# EAGLE design main_board (EAGLE 9.4.2)

## Sheet 1 of 5
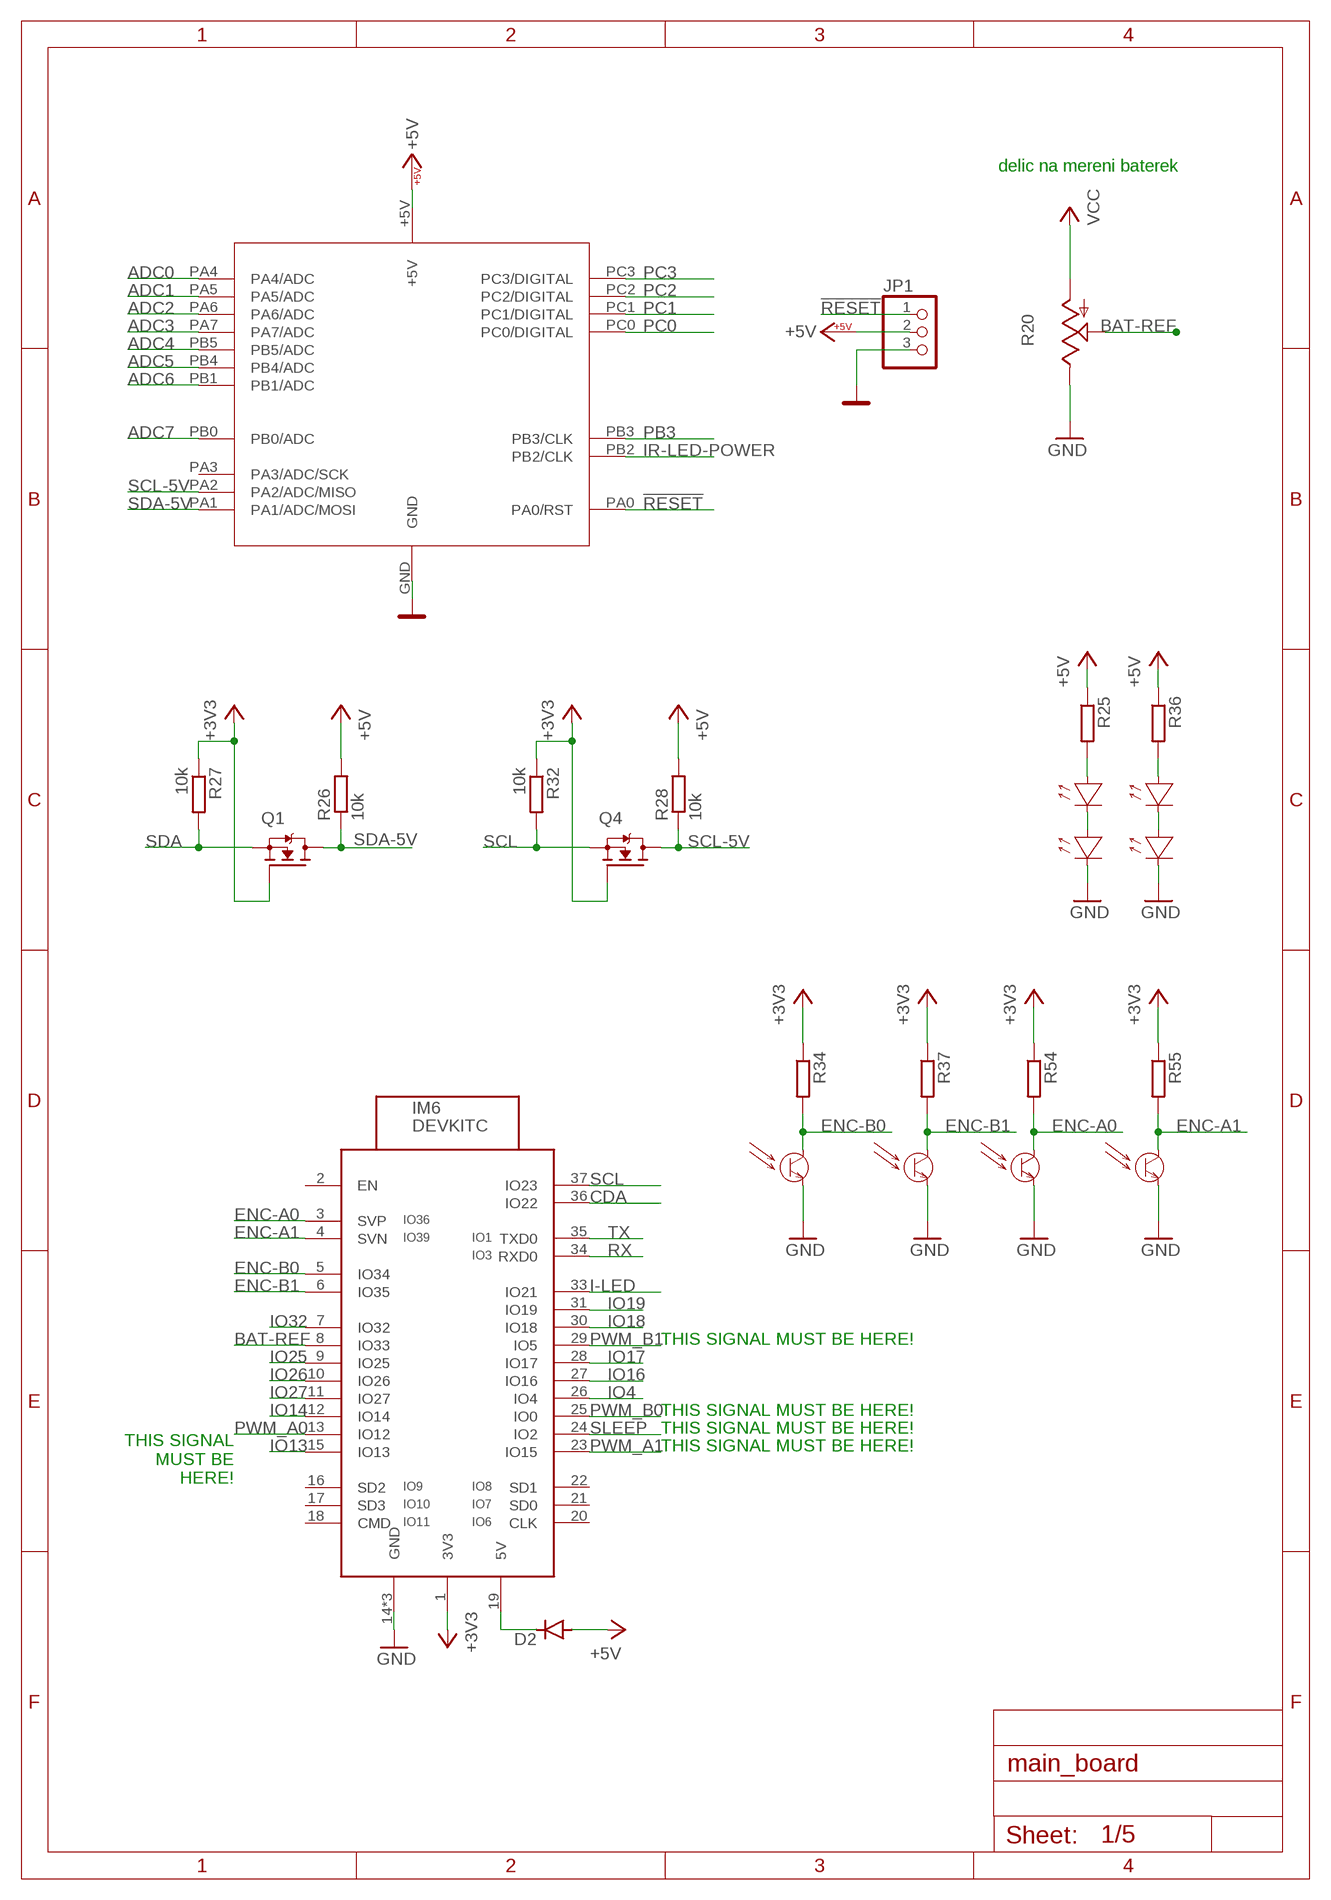
[diagram p0: schematic, sheet 1]

### Parts
D2  DIODE-D-7.5  [D-7.5]
IM6  DEVKITC  [DEVKITC]
JP1  PINHD-1X3  [1X03]
Q1  N-MOSFET-SOT23-DIST  [SOT23_DIST]
Q4  N-MOSFET-SOT23-DIST  [SOT23_DIST]
R20  TRIM_US-SM-42/43X  [SM-42/43X]
R25  R-EU_R0603  [R0603]
R26  10k  R-EU_R0402  [R0402]
R27  10k  R-EU_R0402  [R0402]
R28  10k  R-EU_R0402  [R0402]
R32  10k  R-EU_R0402  [R0402]
R34  R-EU_R0603  [R0603]
R36  R-EU_R0603  [R0603]
R37  R-EU_R0603  [R0603]
R54  R-EU_R0603  [R0603]
R55  R-EU_R0603  [R0603]
U$8  ATTINI1616SOIC  [ATTINY1616-SOIC]
U$11  BIR-NM13C1  [BIR-NM13C1]
U$13  L-NP-3C1  [L-NP-3C1]
U$15  BIR-NM13C1  [BIR-NM13C1]
U$16  BIR-NM13C1  [BIR-NM13C1]
U$20  BIR-NM13C1  [BIR-NM13C1]
U$21  L-NP-3C1  [L-NP-3C1]
U$22  L-NP-3C1  [L-NP-3C1]
U$23  L-NP-3C1  [L-NP-3C1]

### Nets
!RESET: JP1.1 U$8.PA0(PA0/RST)
+3V3: IM6.1(3V3) Q1.1(G) Q4.1(G) R27.1 R32.1 R34.1 R37.1 R54.1 R55.1 ; also sheet 4,5
+5V: D2.A JP1.2 R25.1 R26.2 R28.2 R36.1 U$8.+5V ; also sheet 2,3,4,5
+5V_ESP: D2.C IM6.19(5V)
ADC0: U$8.PA4(PA4/ADC) ; also sheet 3
ADC1: U$8.PA5(PA5/ADC) ; also sheet 3
ADC2: U$8.PA6(PA6/ADC) ; also sheet 3
ADC3: U$8.PA7(PA7/ADC) ; also sheet 3
ADC4: U$8.PB5(PB5/ADC) ; also sheet 3
ADC5: U$8.PB4(PB4/ADC) ; also sheet 3
ADC6: U$8.PB1(PB1/ADC) ; also sheet 3
ADC7: U$8.PB0(PB0/ADC)
BAT-REF: IM6.8(IO33) R20.2(S)
CDA: IM6.36(IO22)
ENC-A0: IM6.3(SVP) R54.2 U$22.PIN
ENC-A1: IM6.4(SVN) R55.2 U$23.PIN
ENC-B0: IM6.5(IO34) R34.2 U$13.PIN
ENC-B1: IM6.6(IO35) R37.2 U$21.PIN
GND: IM6.14(GND) IM6.32(GND) IM6.38(GND) JP1.3 R20.3(E) U$8.GND U$11.GND U$13.GND U$20.GND U$21.GND U$22.GND U$23.GND ; also sheet 2,3,4,5
I-LED: IM6.33(IO21) ; also sheet 5
IO4: IM6.26(IO4) ; also sheet 5
IO13: IM6.15(IO13) ; also sheet 5
IO14: IM6.12(IO14) ; also sheet 5
IO16: IM6.27(IO16) ; also sheet 5
IO17: IM6.28(IO17) ; also sheet 5
IO18: IM6.30(IO18) ; also sheet 5
IO19: IM6.31(IO19) ; also sheet 5
IO25: IM6.9(IO25) ; also sheet 5
IO26: IM6.10(IO26) ; also sheet 5
IO27: IM6.11(IO27) ; also sheet 5
IO32: IM6.7(IO32) ; also sheet 5
IR-LED-POWER: U$8.PB2(PB2/CLK) ; also sheet 3
N$12: R25.2 U$16.PIN(VCC)
N$21: U$11.PIN(VCC) U$16.GND
N$22: R36.2 U$15.PIN(VCC)
N$31: U$15.GND U$20.PIN(VCC)
PB3: U$8.PB3(PB3/CLK) ; also sheet 2
PC0: U$8.PC0(PC0/DIGITAL) ; also sheet 2
PC1: U$8.PC1(PC1/DIGITAL) ; also sheet 2
PC2: U$8.PC2(PC2/DIGITAL) ; also sheet 2
PC3: U$8.PC3(PC3/DIGITAL)
PWM_A0: IM6.13(IO12) ; also sheet 4
PWM_A1: IM6.23(IO15) ; also sheet 4
PWM_B0: IM6.25(IO0) ; also sheet 4
PWM_B1: IM6.29(IO5) ; also sheet 4
RX: IM6.34(RXD0) ; also sheet 5
SCL: IM6.37(IO23) Q4.2(S) R32.2
SCL-5V: Q4.3(D) R28.1 U$8.PA2(PA2/ADC/MISO)
SDA: Q1.2(S) R27.2
SDA-5V: Q1.3(D) R26.1 U$8.PA1(PA1/ADC/MOSI)
SLEEP: IM6.24(IO2) ; also sheet 4
TX: IM6.35(TXD0) ; also sheet 5
VCC: R20.1(A) ; also sheet 4
Unconnected: IM6.2(EN) IM6.16(SD2) IM6.17(SD3) IM6.18(CMD) IM6.20(CLK) IM6.21(SD0) IM6.22(SD1) U$8.PA3(PA3/ADC/SCK)

### Notes on the sheet
- delic na mereni baterek
- THIS SIGNAL MUST BE HERE!
- THIS SIGNAL MUST BE HERE!
- THIS SIGNAL
  MUST BE
  HERE!
- THIS SIGNAL MUST BE HERE!
- THIS SIGNAL MUST BE HERE!

## Sheet 2 of 5
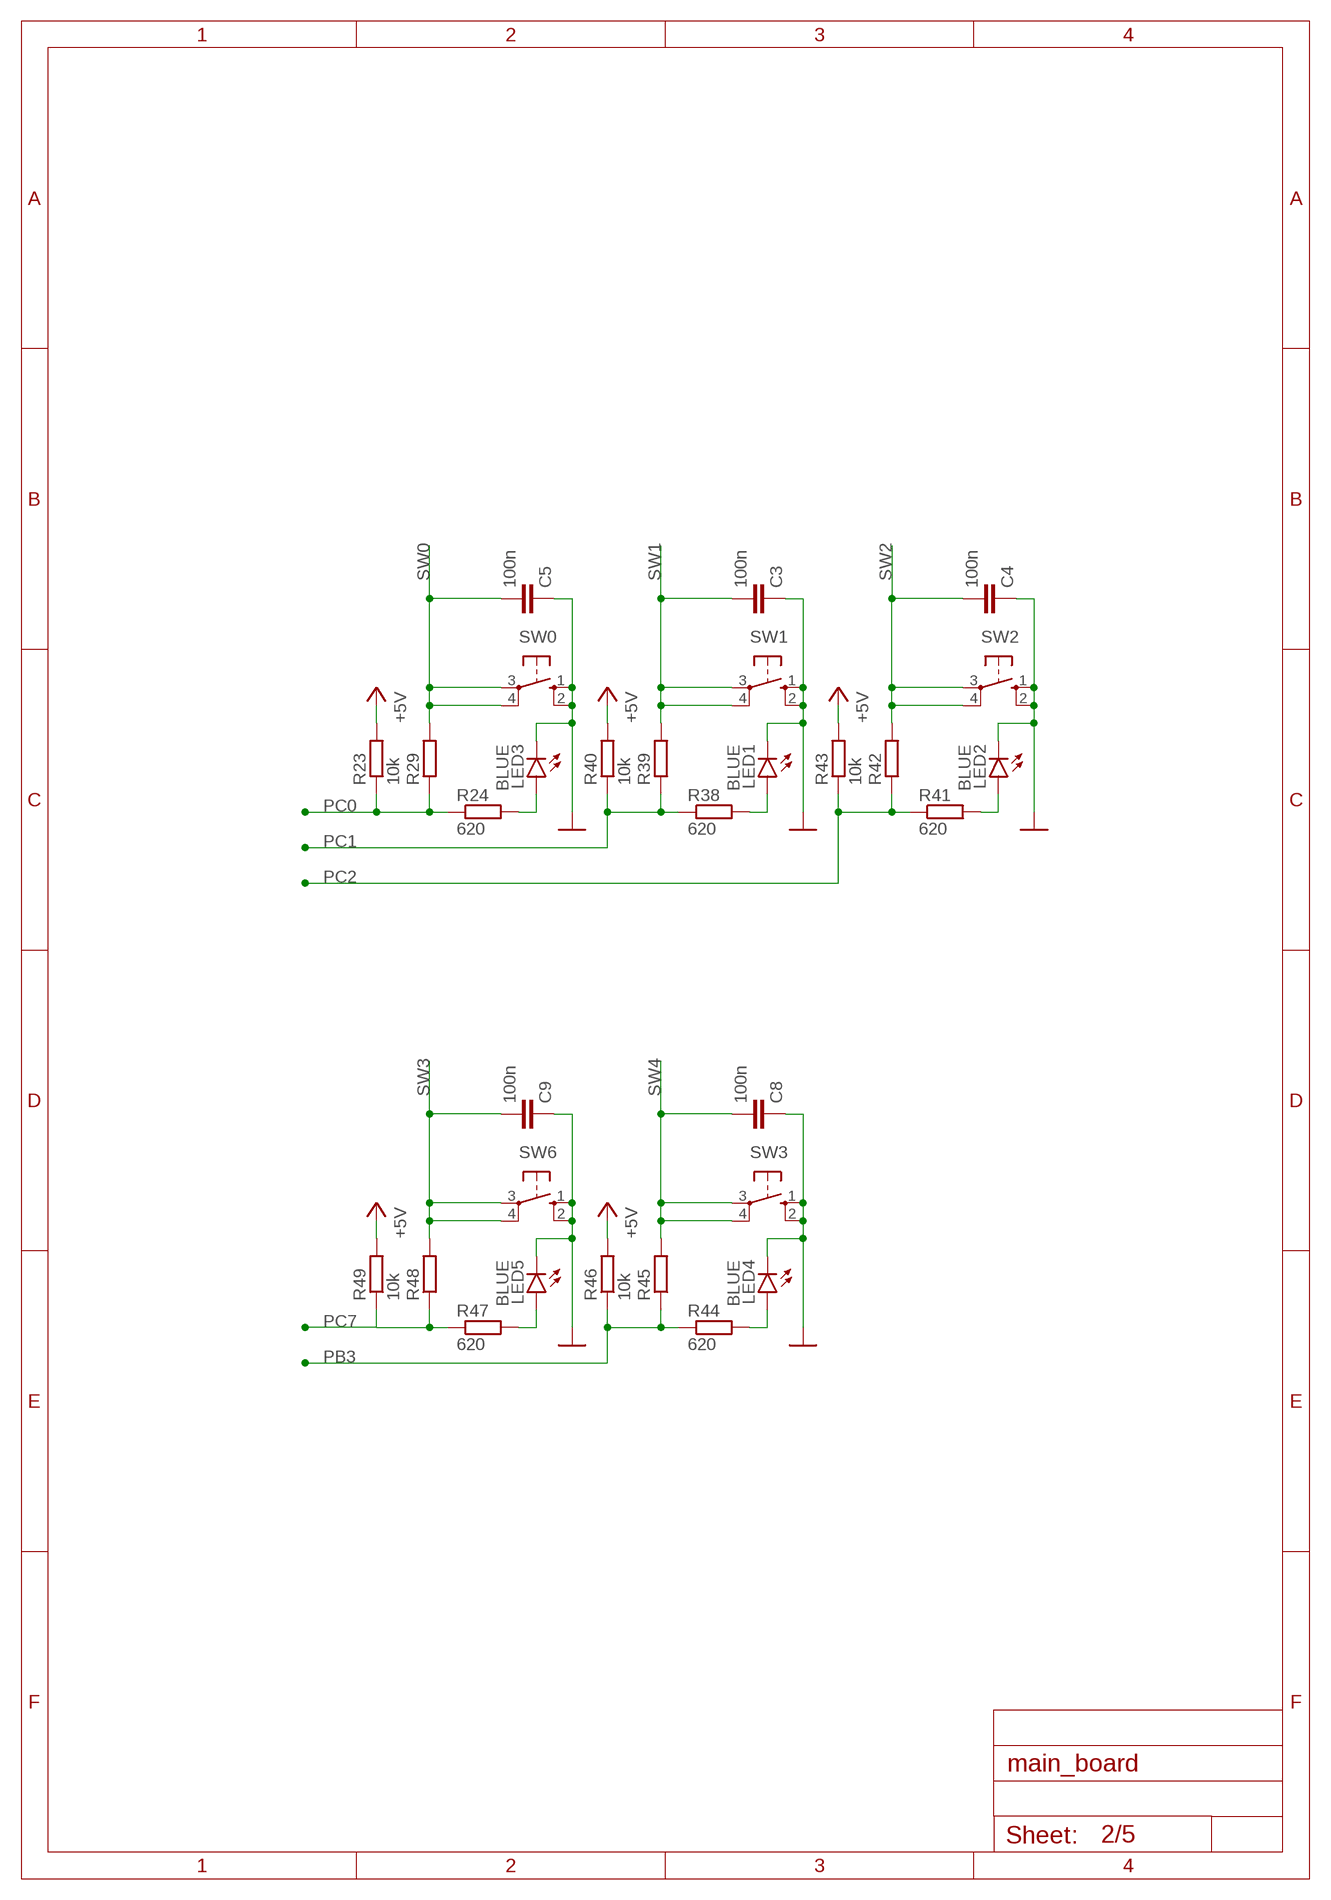
[diagram p1: schematic, sheet 2]

### Parts
C3  100n  C-EUC1206  [C1206]
C4  100n  C-EUC1206  [C1206]
C5  100n  C-EUC1206  [C1206]
C8  100n  C-EUC1206  [C1206]
C9  100n  C-EUC1206  [C1206]
LED1  BLUE  LEDCHIPLED_1206  [CHIPLED_1206]
LED2  BLUE  LEDCHIPLED_1206  [CHIPLED_1206]
LED3  BLUE  LEDCHIPLED_1206  [CHIPLED_1206]
LED4  BLUE  LEDCHIPLED_1206  [CHIPLED_1206]
LED5  BLUE  LEDCHIPLED_1206  [CHIPLED_1206]
R23  10k  R-EU_R0805  [R0805]
R24  620  R-EU_R0805  [R0805]
R29  R-EU_R0805  [R0805]
R38  620  R-EU_R0805  [R0805]
R39  R-EU_R0805  [R0805]
R40  10k  R-EU_R0805  [R0805]
R41  620  R-EU_R0805  [R0805]
R42  R-EU_R0805  [R0805]
R43  10k  R-EU_R0805  [R0805]
R44  620  R-EU_R0805  [R0805]
R45  R-EU_R0805  [R0805]
R46  10k  R-EU_R0805  [R0805]
R47  620  R-EU_R0805  [R0805]
R48  R-EU_R0805  [R0805]
R49  10k  R-EU_R0805  [R0805]
SW0  10-XX  [B3F-10XX]
SW1  10-XX  [B3F-10XX]
SW2  10-XX  [B3F-10XX]
SW3  10-XX  [B3F-10XX]
SW6  10-XX  [B3F-10XX]

### Nets
+5V: R23.2 R40.2 R43.2 R46.2 R49.2 ; also sheet 1,3,4,5
GND: C3.1 C4.1 C5.1 C8.1 C9.1 LED1.C LED2.C LED3.C LED4.C LED5.C SW0.1(S) SW0.2(S1) SW1.1(S) SW1.2(S1) SW2.1(S) SW2.2(S1) SW3.1(S) SW3.2(S1) SW6.1(S) SW6.2(S1) ; also sheet 1,3,4,5
N$10: LED3.A R24.2
N$24: LED2.A R41.2
N$26: LED1.A R38.2
N$27: LED4.A R44.2
N$28: LED5.A R47.2
PB3: R44.1 R45.1 R46.1 ; also sheet 1
PC0: R23.1 R24.1 R29.1 ; also sheet 1
PC1: R38.1 R39.1 R40.1 ; also sheet 1
PC2: R41.1 R42.1 R43.1 ; also sheet 1
PC7: R47.1 R48.1 R49.1
SW0: C5.2 R29.2 SW0.3(P) SW0.4(P1) ; also sheet 5
SW1: C3.2 R39.2 SW1.3(P) SW1.4(P1) ; also sheet 5
SW2: C4.2 R42.2 SW2.3(P) SW2.4(P1) ; also sheet 5
SW3: C9.2 R48.2 SW6.3(P) SW6.4(P1) ; also sheet 5
SW4: C8.2 R45.2 SW3.3(P) SW3.4(P1) ; also sheet 5

## Sheet 3 of 5
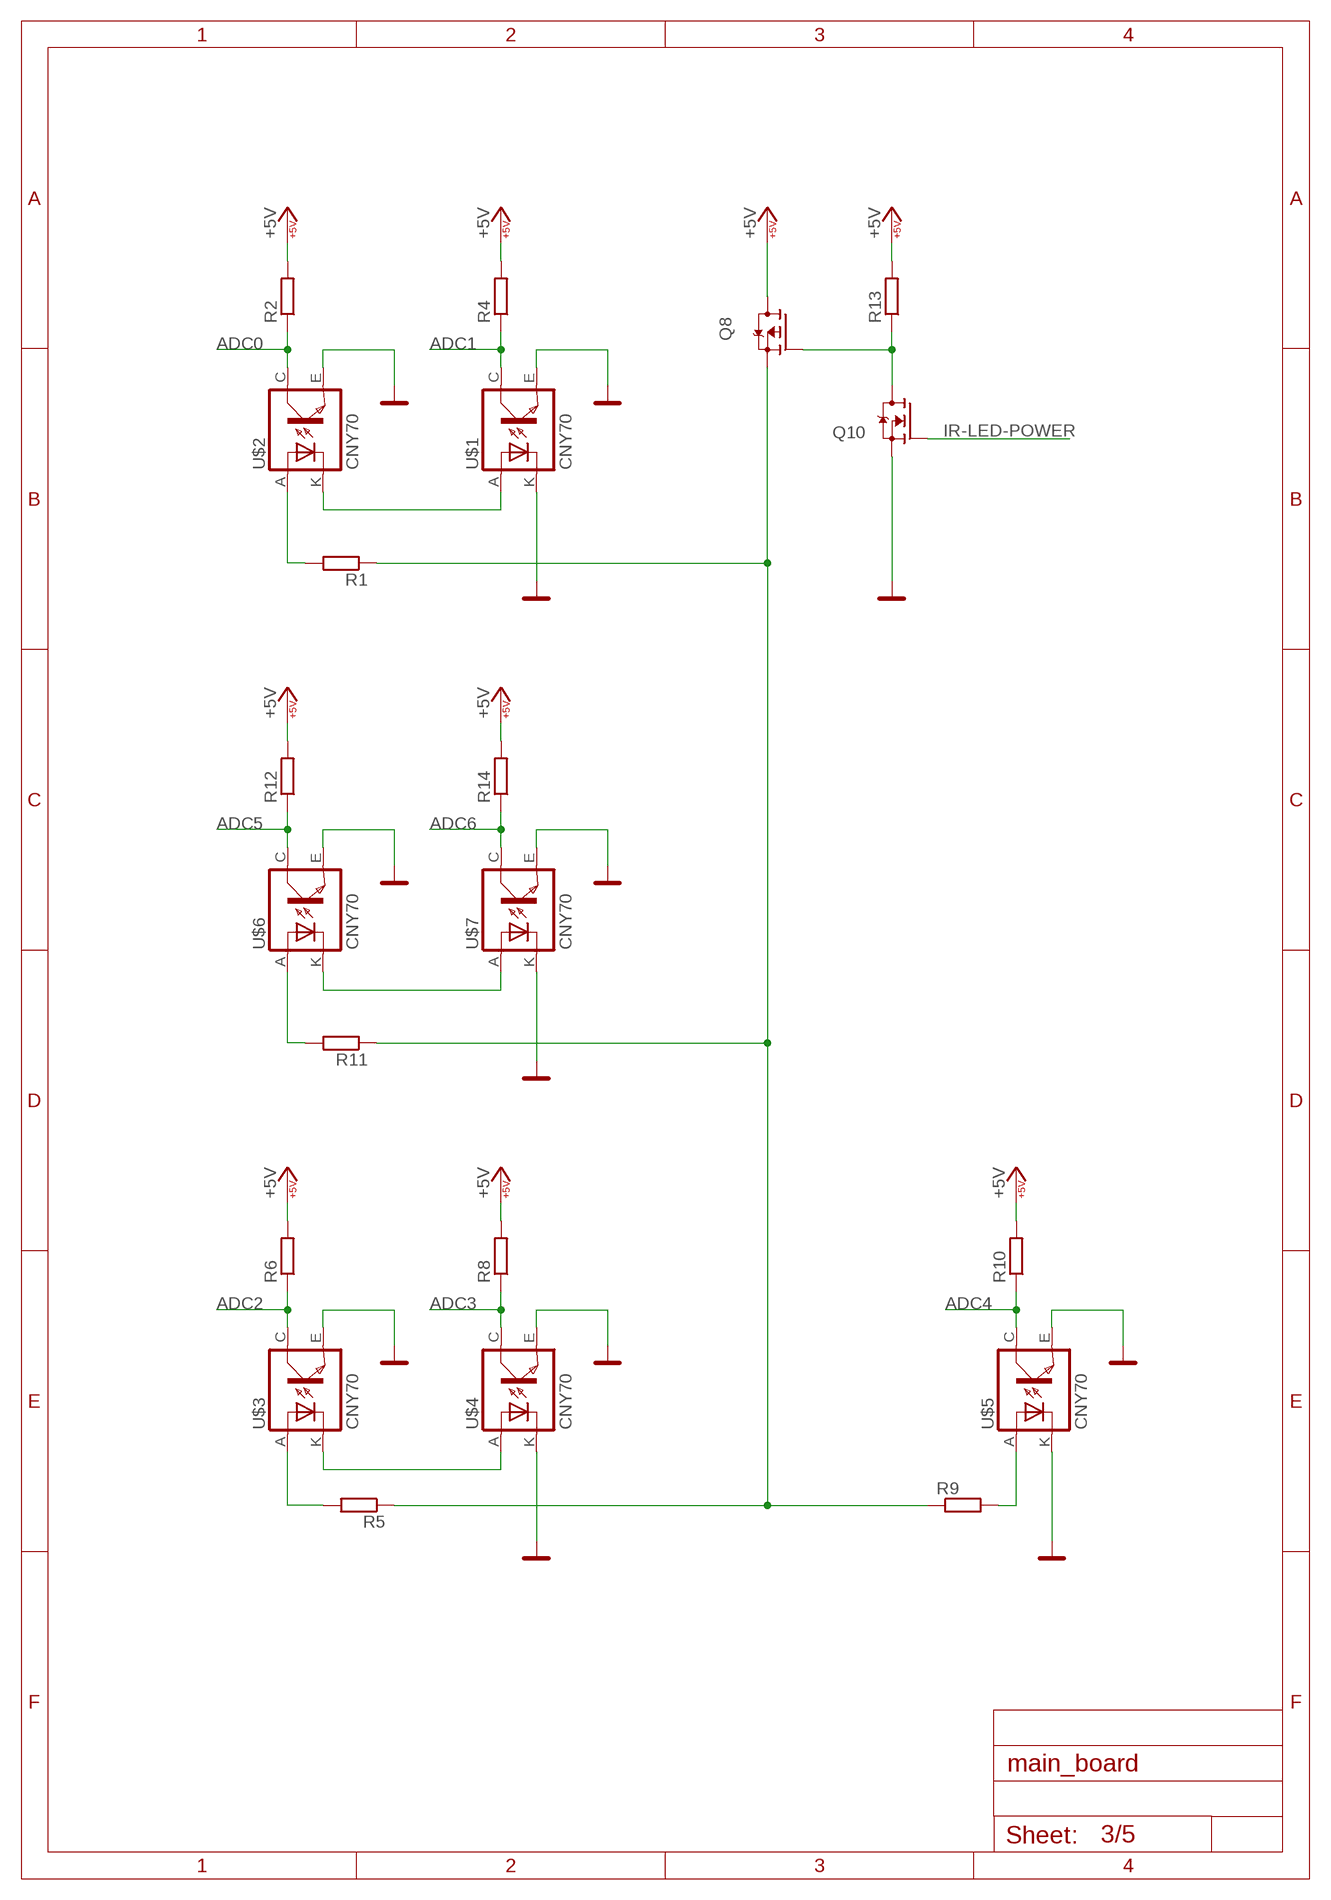
[diagram p2: schematic, sheet 3]

### Parts
Q8  P-MOSFET-MLP_HS  [MLP3.3X3.3_HS]
Q10  N-MOSFET-SOT23-GSD  [SOT23]
R1  R-EU_R0603  [R0603]
R2  R-EU_R0603  [R0603]
R4  R-EU_R0603  [R0603]
R5  R-EU_R0603  [R0603]
R6  R-EU_R0603  [R0603]
R8  R-EU_R0603  [R0603]
R9  R-EU_R0603  [R0603]
R10  R-EU_R0603  [R0603]
R11  R-EU_R0603  [R0603]
R12  R-EU_R0603  [R0603]
R13  R-EU_R0603  [R0603]
R14  R-EU_R0603  [R0603]
U$1  CNY70  [4]
U$2  CNY70  [4]
U$3  CNY70  [4]
U$4  CNY70  [4]
U$5  CNY70  [4]
U$6  CNY70  [4]
U$7  CNY70  [4]

### Nets
+5V: Q8.5(D) Q8.6(D) Q8.7(D) Q8.8(D) R2.2 R4.2 R6.2 R8.2 R10.2 R12.2 R13.2 R14.2 ; also sheet 1,2,4,5
ADC0: R2.1 U$2.C(COL) ; also sheet 1
ADC1: R4.1 U$1.C(COL) ; also sheet 1
ADC2: R6.1 U$3.C(COL) ; also sheet 1
ADC3: R8.1 U$4.C(COL) ; also sheet 1
ADC4: R10.1 U$5.C(COL) ; also sheet 1
ADC5: R12.1 U$6.C(COL) ; also sheet 1
ADC6: R14.1 U$7.C(COL) ; also sheet 1
GND: Q10.2(S) U$1.E(EMI) U$1.K(C) U$2.E(EMI) U$3.E(EMI) U$4.E(EMI) U$4.K(C) U$5.E(EMI) U$5.K(C) U$6.E(EMI) U$7.E(EMI) U$7.K(C) ; also sheet 1,2,4,5
IR-LED-POWER: Q10.1(G) ; also sheet 1
N$1: R1.2 U$2.A
N$2: U$1.A U$2.K(C)
N$3: R5.2 U$3.A
N$4: U$3.K(C) U$4.A
N$5: R9.2 U$5.A
N$6: R11.2 U$6.A
N$29: U$6.K(C) U$7.A
N$34: Q8.1(S) Q8.2(S) Q8.3(S) R1.1 R5.1 R9.1 R11.1
N$36: Q8.4(G) Q10.3(D) R13.1

## Sheet 4 of 5
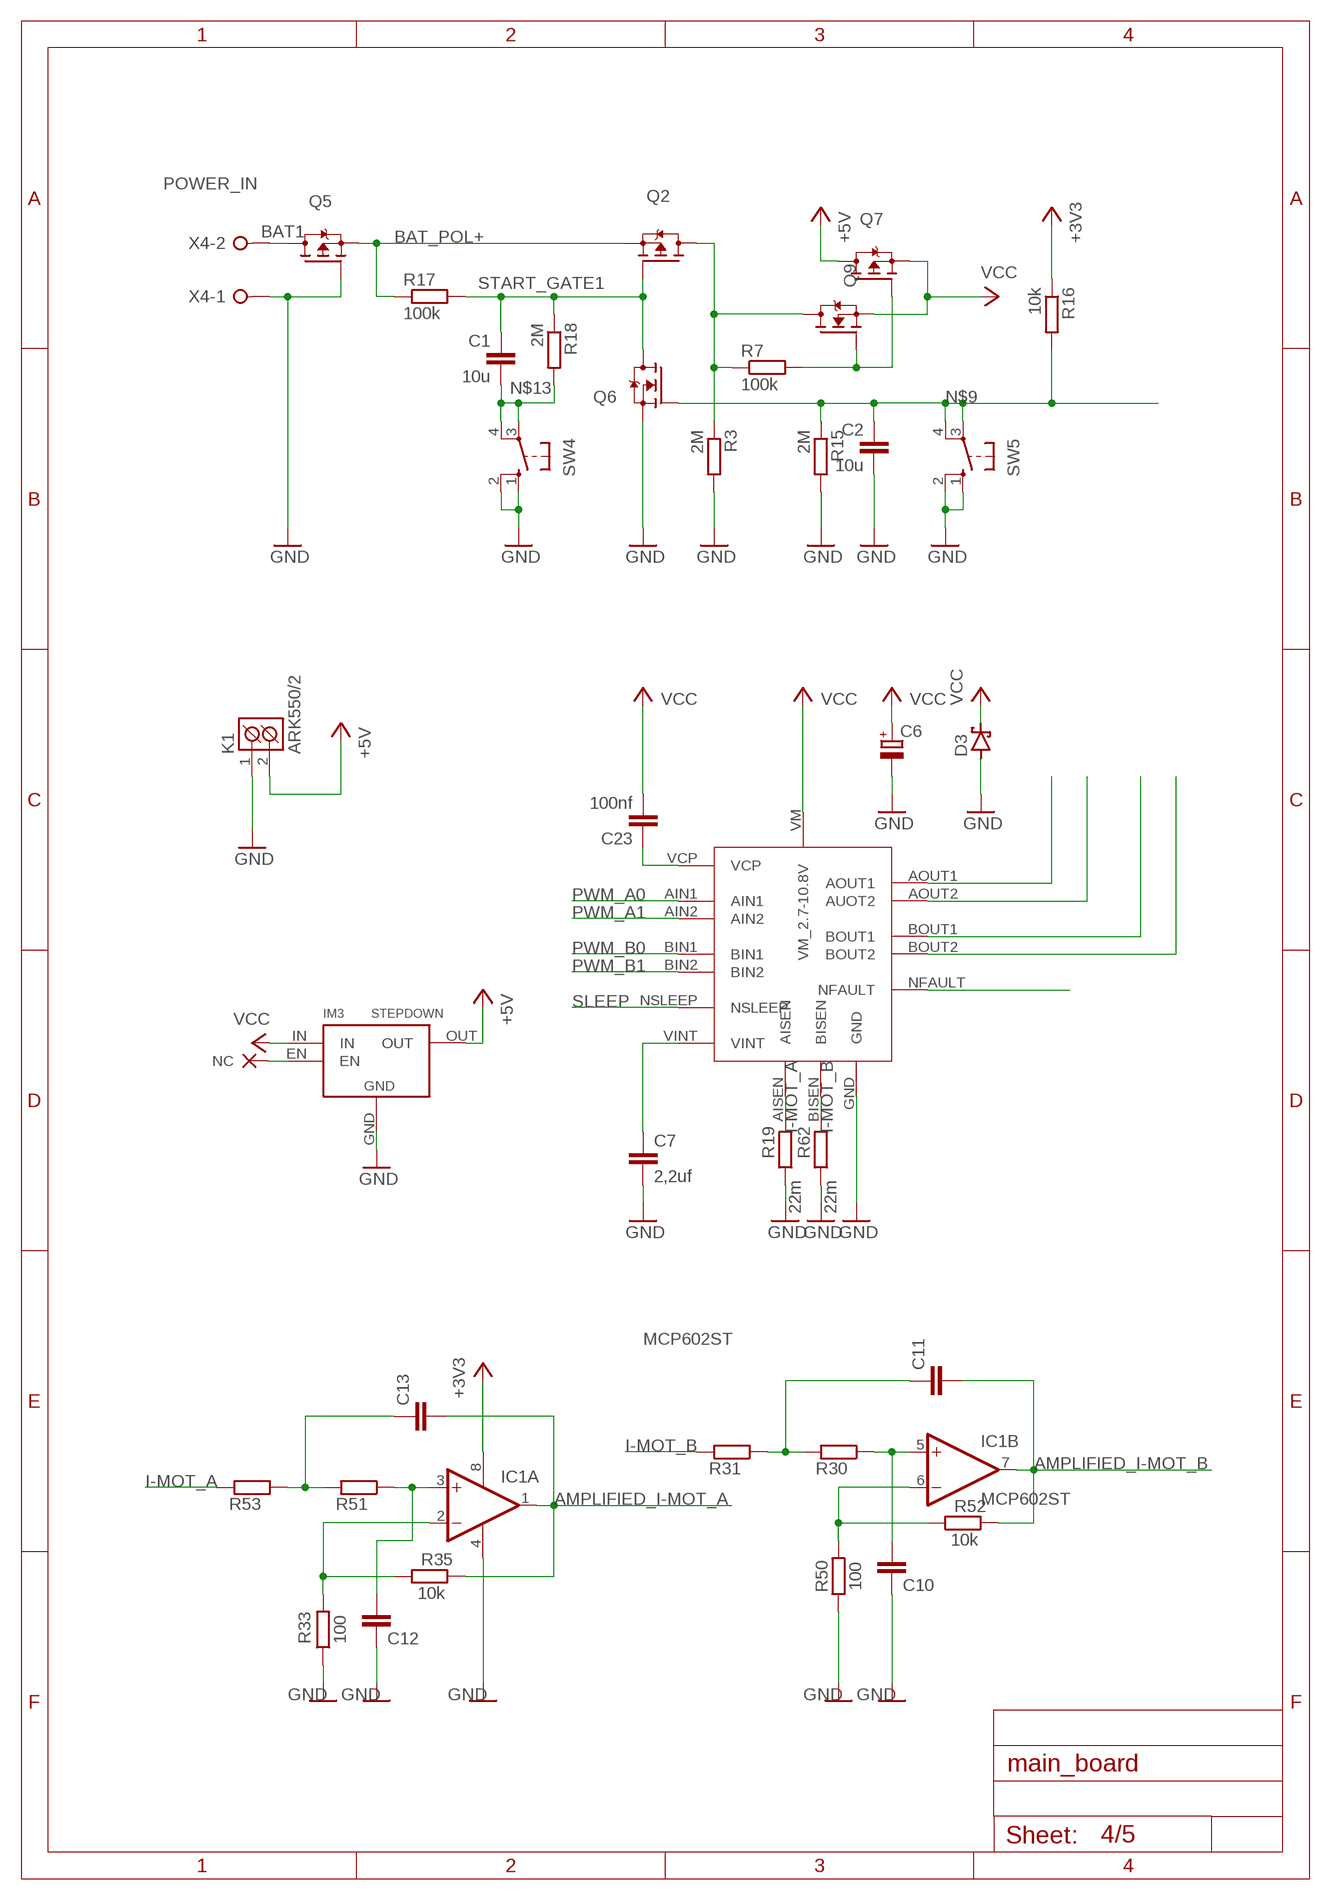
[diagram p3: schematic, sheet 4]

### Parts
C1  10u  C-EUC1206  [C1206]
C2  10u  C-EUC1206  [C1206]
C6  CPOL-EUE5-10.5  [E5-10,5]
C7  2,2uf  C-EUC0805  [C0805]
C10  C-EUC1206  [C1206]
C11  C-EUC1206  [C1206]
C12  C-EUC1206  [C1206]
C13  C-EUC1206  [C1206]
C23  100nf  C-EUC0603  [C0603]
D3  SCHOTTKY-DIODEF126Z12  [F126Z12]
IC1  MCP602ST  [TSSOP8]
IM3  STEPDOWN  [STEPDOWN]
K1  ARK550/2  [ARK550/2]
NC1  NC  (no package)
Q2  P-MOSFET-MLP_HS  [MLP3.3X3.3_HS]
Q5  P-MOSFET-MLP_HS  [MLP3.3X3.3_HS]
Q6  N-MOSFET-SOT23-GSD  [SOT23]
Q7  P-MOSFET-MLP_HS  [MLP3.3X3.3_HS]
Q9  N-MOSFET-SOT23-GSD  [SOT23]
R3  2M  R-EU_R0805  [R0805]
R7  100k  R-EU_R0805  [R0805]
R15  2M  R-EU_R0805  [R0805]
R16  10k  R-EU_R0805  [R0805]
R17  100k  R-EU_R0805  [R0805]
R18  2M  R-EU_M0805  [M0805]
R19  22m  R-EU_R0603  [R0603]
R30  R-EU_R0603  [R0603]
R31  R-EU_R0603  [R0603]
R33  100  R-EU_R0603  [R0603]
R35  10k  R-EU_R0603  [R0603]
R50  100  R-EU_R0603  [R0603]
R51  R-EU_R0603  [R0603]
R52  10k  R-EU_R0603  [R0603]
R53  R-EU_R0603  [R0603]
R62  22m  R-EU_R0603  [R0603]
SW4  10-XX  [B3F-10XX]
SW5  10-XX  [B3F-10XX]
U$9  DRV8833HTSSOP  [HTSSOP]
X4  POWER_IN  W237-02P  [W237-132]

### Nets
+3V3: IC1.8(P:V+) R16.1 ; also sheet 1,5
+5V: IM3.OUT K1.2(K2) Q7.5(D) Q7.6(D) Q7.7(D) Q7.8(D) ; also sheet 1,2,3,5
AMPLIFIED_I-MOT_A: C13.2 IC1.1(A:OUT) R35.2
AMPLIFIED_I-MOT_B: C11.2 IC1.7(B:OUT) R52.2
BAT1: Q5.5(D) Q5.6(D) Q5.7(D) Q5.8(D) X4.2
BAT_POL+: Q2.1(S) Q2.2(S) Q2.3(S) Q5.1(S) Q5.2(S) Q5.3(S) R17.1
GND: C2.2 C6.- C7.2 C10.2 C12.2 D3.A IC1.4(P:V-) IM3.GND K1.1(K1) Q5.4(G) Q6.2(S) R3.2 R15.2 R19.1 R33.1 R50.1 R62.1 SW4.1(S) SW4.2(S1) SW5.1(S) SW5.2(S1) U$9.GND X4.1 ; also sheet 1,2,3,5
I-MOT_A: R19.2 R53.2 U$9.AISEN
I-MOT_B: R31.2 R62.2 U$9.BISEN
IO9_NC2: IM3.EN NC1.NC
N$7: Q2.5(D) Q2.6(D) Q2.7(D) Q2.8(D) Q9.3(D) R3.1 R7.1
N$8: U$9.AOUT1
N$9: C2.1 Q6.1(G) R15.1 R16.2 SW5.3(P) SW5.4(P1)
N$13: C1.2 R18.2 SW4.3(P) SW4.4(P1)
N$14: U$9.AOUT2(AUOT2)
N$15: U$9.BOUT1
N$16: U$9.BOUT2
N$17: U$9.NFAULT
N$18: C11.1 R30.2 R31.1
N$19: C10.1 IC1.5(B:+IN) R30.1
N$20: IC1.2(A:-IN) R33.2 R35.1
N$23: C7.1 U$9.VINT
N$25: C23.1 U$9.VCP
N$30: IC1.6(B:-IN) R50.2 R52.1
N$32: C13.1 R51.2 R53.1
N$33: C12.1 IC1.3(A:+IN) R51.1
N$35: Q7.4(G) Q9.1(G) R7.2
PWM_A0: U$9.AIN1 ; also sheet 1
PWM_A1: U$9.AIN2 ; also sheet 1
PWM_B0: U$9.BIN1 ; also sheet 1
PWM_B1: U$9.BIN2 ; also sheet 1
SLEEP: U$9.NSLEEP ; also sheet 1
START_GATE1: C1.1 Q2.4(G) Q6.3(D) R17.2 R18.1
VCC: C6.+ C23.2 D3.C IM3.IN Q7.1(S) Q7.2(S) Q7.3(S) Q9.2(S) U$9.VM(VM_2.7-10.8V) ; also sheet 1

## Sheet 5 of 5
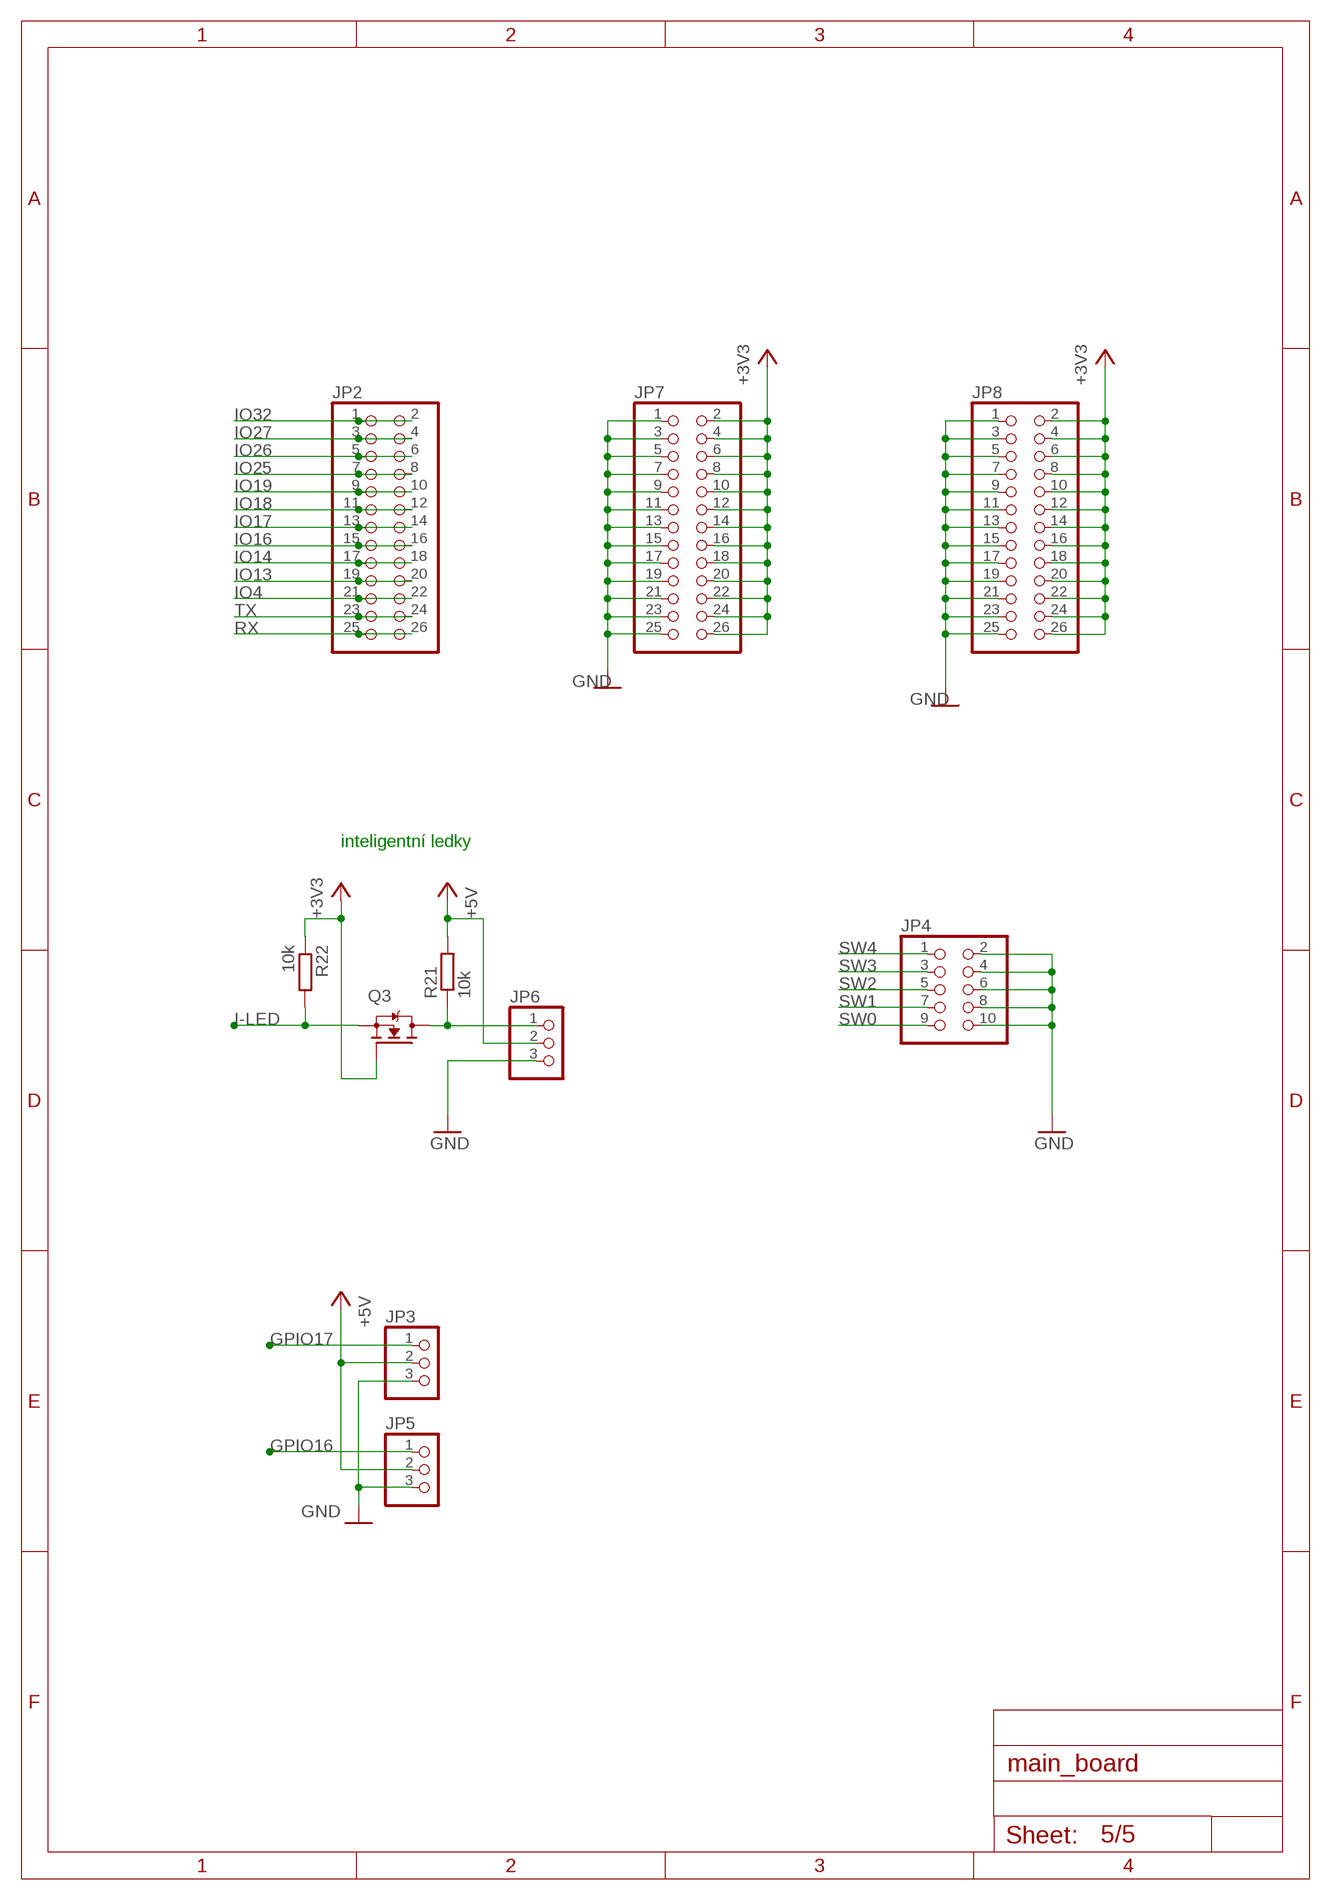
[diagram p4: schematic, sheet 5]

### Parts
JP2  PINHD-2X13  [2X13]
JP3  PINHD-1X3  [1X03]
JP4  PINHD-2X5  [2X05]
JP5  PINHD-1X3  [1X03]
JP6  PINHD-1X3  [1X03]
JP7  PINHD-2X13  [2X13]
JP8  PINHD-2X13  [2X13]
Q3  N-MOSFET-SOT23-DIST  [SOT23_DIST]
R21  10k  R-EU_R0402  [R0402]
R22  10k  R-EU_R0402  [R0402]

### Nets
+3V3: JP7.2 JP7.4 JP7.6 JP7.8 JP7.10 JP7.12 JP7.14 JP7.16 JP7.18 JP7.20 JP7.22 JP7.24 JP7.26 JP8.2 JP8.4 JP8.6 JP8.8 JP8.10 JP8.12 JP8.14 JP8.16 JP8.18 JP8.20 JP8.22 JP8.24 JP8.26 Q3.1(G) R22.1 ; also sheet 1,4
+5V: JP3.2 JP5.2 JP6.2 R21.2 ; also sheet 1,2,3,4
GND: JP3.3 JP4.2 JP4.4 JP4.6 JP4.8 JP4.10 JP5.3 JP6.3 JP7.1 JP7.3 JP7.5 JP7.7 JP7.9 JP7.11 JP7.13 JP7.15 JP7.17 JP7.19 JP7.21 JP7.23 JP7.25 JP8.1 JP8.3 JP8.5 JP8.7 JP8.9 JP8.11 JP8.13 JP8.15 JP8.17 JP8.19 JP8.21 JP8.23 JP8.25 ; also sheet 1,2,3,4
GPIO16: JP5.1
GPIO17: JP3.1
I-LED: Q3.2(S) R22.2 ; also sheet 1
IO4: JP2.21 JP2.22 ; also sheet 1
IO13: JP2.19 JP2.20 ; also sheet 1
IO14: JP2.17 JP2.18 ; also sheet 1
IO16: JP2.15 JP2.16 ; also sheet 1
IO17: JP2.13 JP2.14 ; also sheet 1
IO18: JP2.11 JP2.12 ; also sheet 1
IO19: JP2.9 JP2.10 ; also sheet 1
IO25: JP2.7 JP2.8 ; also sheet 1
IO26: JP2.5 JP2.6 ; also sheet 1
IO27: JP2.3 JP2.4 ; also sheet 1
IO32: JP2.1 JP2.2 ; also sheet 1
N$11: JP6.1 Q3.3(D) R21.1
RX: JP2.25 JP2.26 ; also sheet 1
SW0: JP4.9 ; also sheet 2
SW1: JP4.7 ; also sheet 2
SW2: JP4.5 ; also sheet 2
SW3: JP4.3 ; also sheet 2
SW4: JP4.1 ; also sheet 2
TX: JP2.23 JP2.24 ; also sheet 1

### Notes on the sheet
- inteligentní ledky

## Library data of the parts
C1-C5 C8 C9 = rcl_upravena:C-EU: CAPACITOR, European symbol
C6 = rcl:CPOL-EU: POLARIZED CAPACITOR, European symbol; SPICEPREFIX: C
C7 C10-C13 C23 = resistor:C-EU: CAPACITOR, European symbol
D2 = diode:DIODE-: DIODE
D3 = diode:SCHOTTKY-DIODE: Schottky Diode
IC1 = linear:MCP602: Single Op Amp 2.7V to 6.0V Single Supply CMOS Source: http://ww1.microchip.com/downloads/en/DeviceDoc/21314g.pdf
IM3 = StepDown:STEPDOWN
IM6 = esp32:DEVKITC
JP1 JP3 JP5 JP6 = pinhead:PINHD-1X3: PIN HEADER
JP2 JP7 JP8 = pinhead:PINHD-2X13: PIN HEADER
JP4 = pinhead:PINHD-2X5: PIN HEADER
K1 = #PaJa_konektory:ARK550/2: Svorkovnice - roztec 3,5mm - dvojita
LED1-LED5 = led:LED: LED OSRAM: - CHIPLED LG R971, LG N971, LY N971, LG Q971, LY Q971, LO R971, LY R971 LH N974, LH R974 LS Q976, LO Q976, LY Q976 LO Q996 - Hyper CHIPLED LW Q18S LB Q993, LB Q99A, LB R99A - SideLED LS A670, LO A670, LY A670, LG A670, LP A670 LB A673, LV A673, LT A673, LW A673 LH A674 LY A675 LS A676, LA A676, LO A676, LY A676, LW A676 LS A679, LY A679, LG A679 - Hyper Micro SIDELED® LS Y876, LA Y876, LO Y876, LY Y876 LT Y87S - SmartLED LW L88C, LW L88S LB L89C, LB L89S, LG L890 LS L89K, LO L89K, LY L89K LS L896, LA L896, LO L896, LY L896 - TOPLED LS T670, LO T670, LY T670, LG T670, LP T670 LSG T670, LSP T670, LSY T670, LOP T670, LYG T670 LG T671, LOG T671, LSG T671 LB T673, LV T673, LT T673, LW T673 LH T674 LS T676, LA T676, LO T676, LY T676, LB T676, LH T676, LSB T676, LW T676 LB T67C, LV T67C, LT T67C, LS T67K, LO T67K, LY T67K, LW E67C LS E67B, LA E67B, LO E67B, LY E67B, LB E67C, LV E67C, LT E67C LW T67C LS T679, LY T679, LG T679 LS T770, LO T770, LY T770, LG T770, LP T770 LB T773, LV T773, LT T773, LW T773 LH T774 LS E675, LA E675, LY E675, LS T675 LS T776, LA T776, LO T776, LY T776, LB T776 LHGB T686 LT T68C, LB T68C - Hyper Mini TOPLED® LB M676 - Mini TOPLED Santana® LG M470 LS M47K, LO M47K, LY M47K Source: http://www.osram.convergy.de LUXEON: - LUMILED® LXK2-PW12-R00, LXK2-PW12-S00, LXK2-PW14-U00, LXK2-PW14-V00 LXK2-PM12-R00, LXK2-PM12-S00, LXK2-PM14-U00 LXK2-PE12-Q00, LXK2-PE12-R00, LXK2-PE12-S00, LXK2-PE14-T00, LXK2-PE14-U00 LXK2-PB12-K00, LXK2-PB12-L00, LXK2-PB12-M00, LXK2-PB14-N00, LXK2-PB14-P00, LXK2-PB14-Q00 LXK2-PR12-L00, LXK2-PR12-M00, LXK2-PR14-Q00, LXK2-PR14-R00 LXK2-PD12-Q00, LXK2-PD12-R00, LXK2-PD12-S00 LXK2-PH12-R00, LXK2-PH12-S00 LXK2-PL12-P00, LXK2-PL12-Q00, LXK2-PL12-R00 Source: www.luxeon.com KINGBRIGHT: KA-3528ASYC Source: www.kingbright.com
NC1 = NC:NC: _EXTERNAL_
Q1 Q3 Q4 Q6 Q9 Q10 = transistors:N-MOSFET
Q2 Q5 Q7 Q8 = transistors:P-MOSFET
R1 R2 R4-R6 R8-R14 R19 R21-R55 R62 = resistor:R-EU_: RESISTOR, European symbol
R3 R7 R15-R18 = rcl_upravena:R-EU_: RESISTOR, European symbol
R20 = pot:TRIM_US-: POTENTIOMETER
SW0 SW1-SW6 = switch-omron:10-XX: OMRON SWITCH; MPN: B3F-1000; OC_FARNELL: 176432; OC_NEWARK: 36M3542
U$1-U$7 = cny70:CNY70
U$8 = ATTINY1616:ATTINI1616
U$9 = texas-cc2541:DRV8833
U$11 U$15 U$16 U$20 = led-brt:BIR-NM13C1
U$13 U$21-U$23 = led-brt:L-NP-3C1
X4 = con-wago-508:W237-02P: WAGO SREW CLAMP; OC_FARNELL: unknown; OC_NEWARK: unknown

## Net classes
0 default: width 0.2 mm, drill 0.35 mm, clearance 0.2 mm

## Board
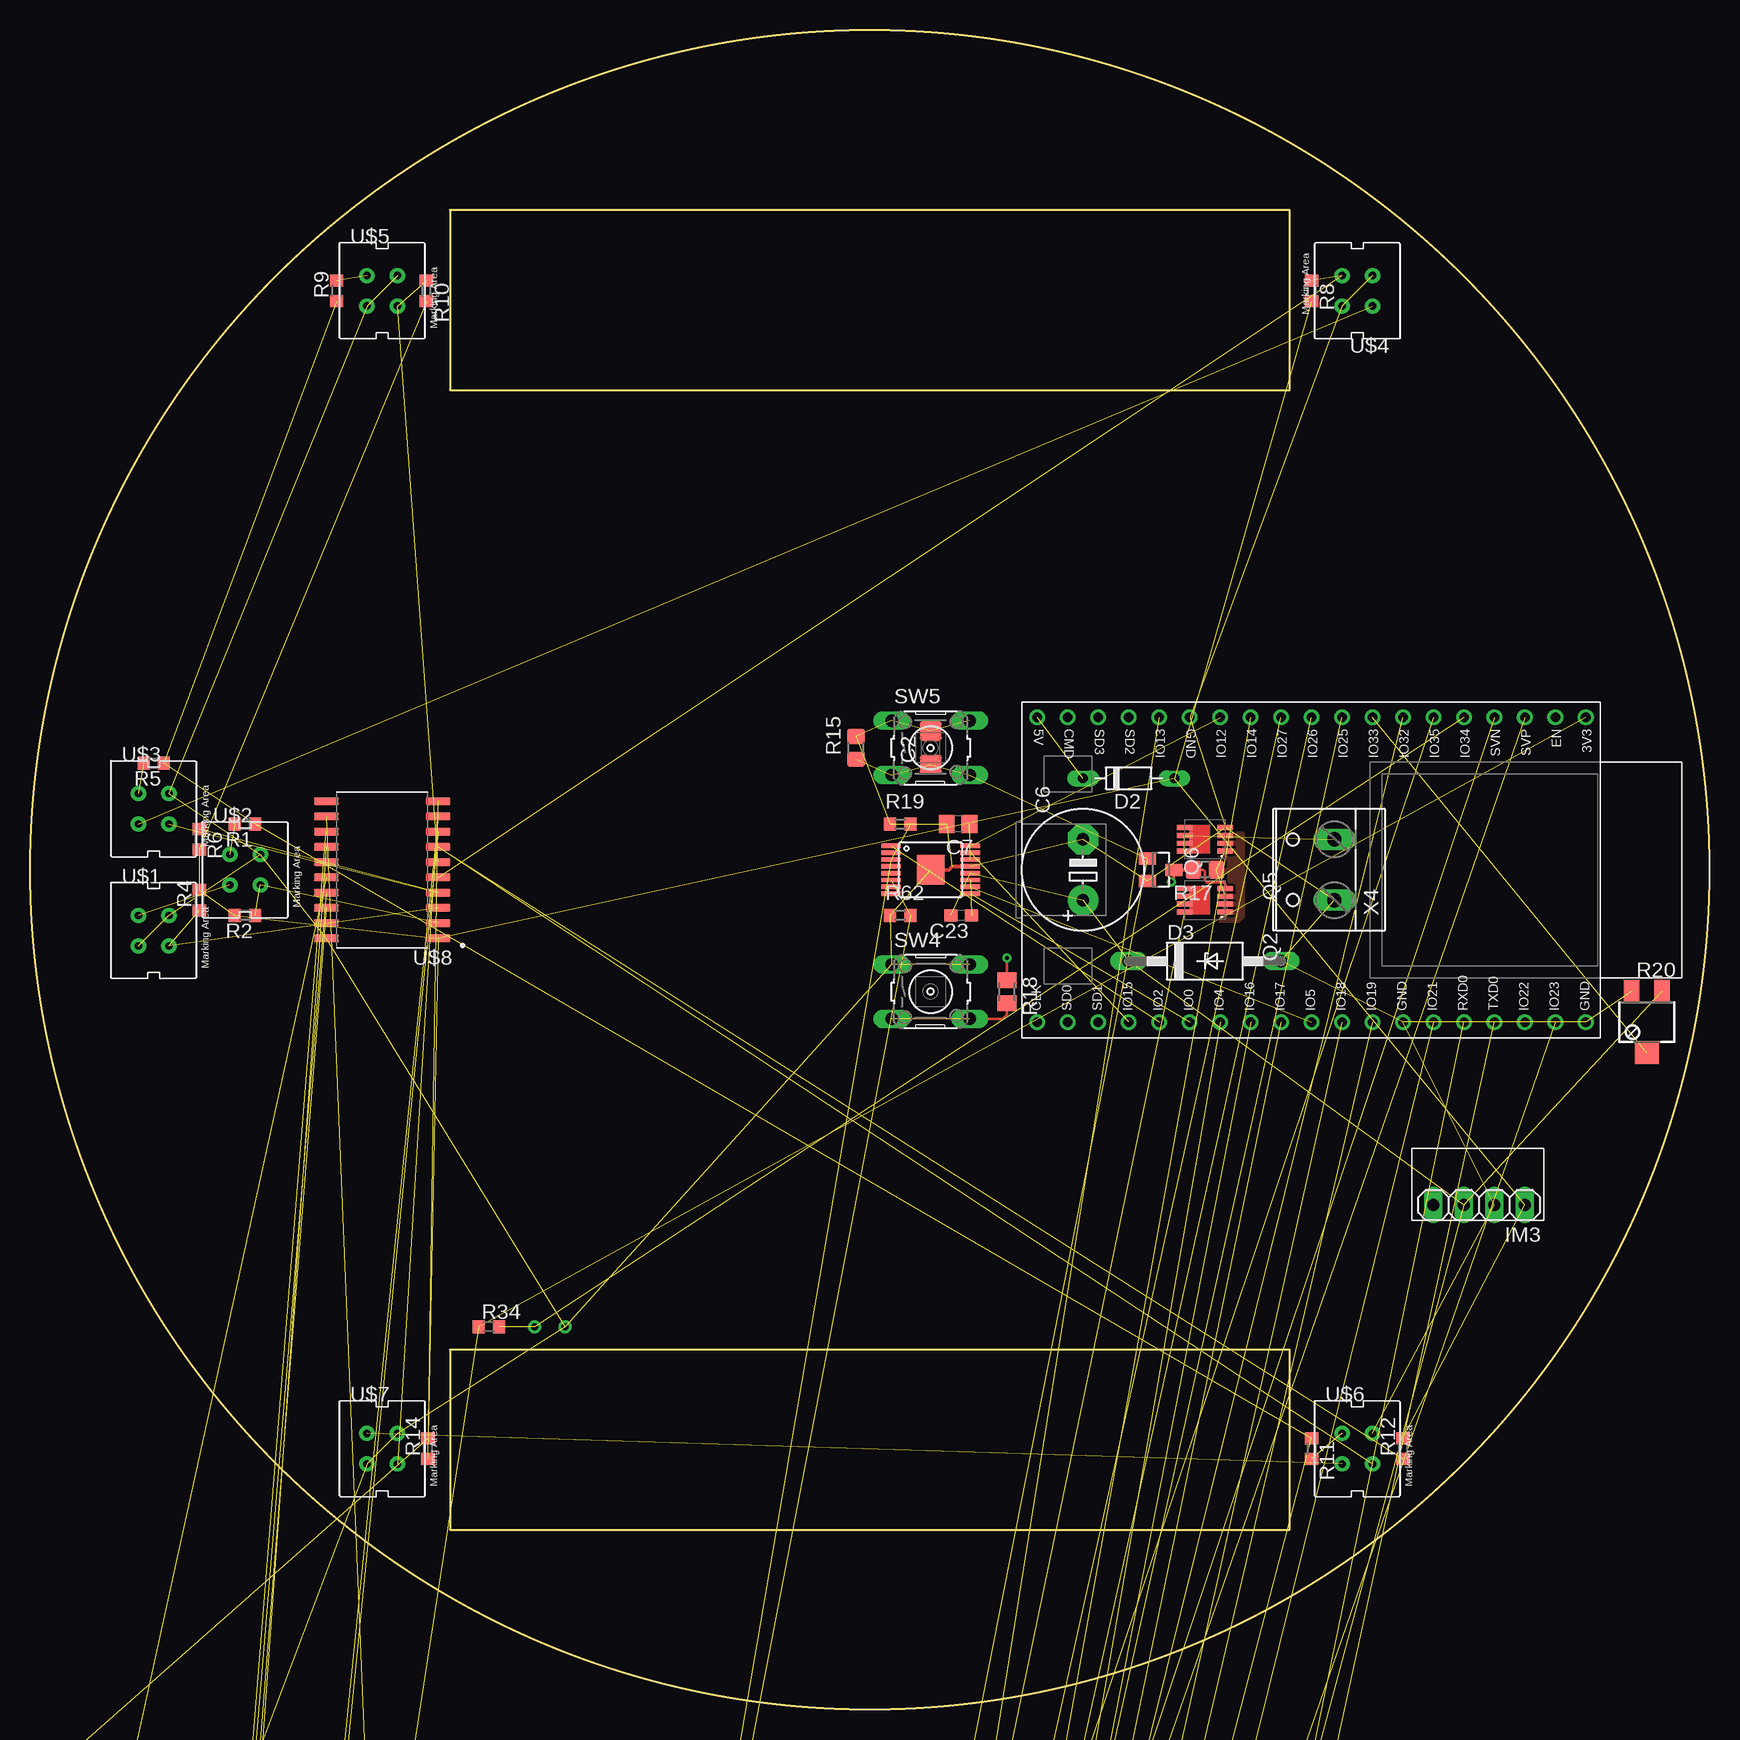
[diagram p5: board, top side]
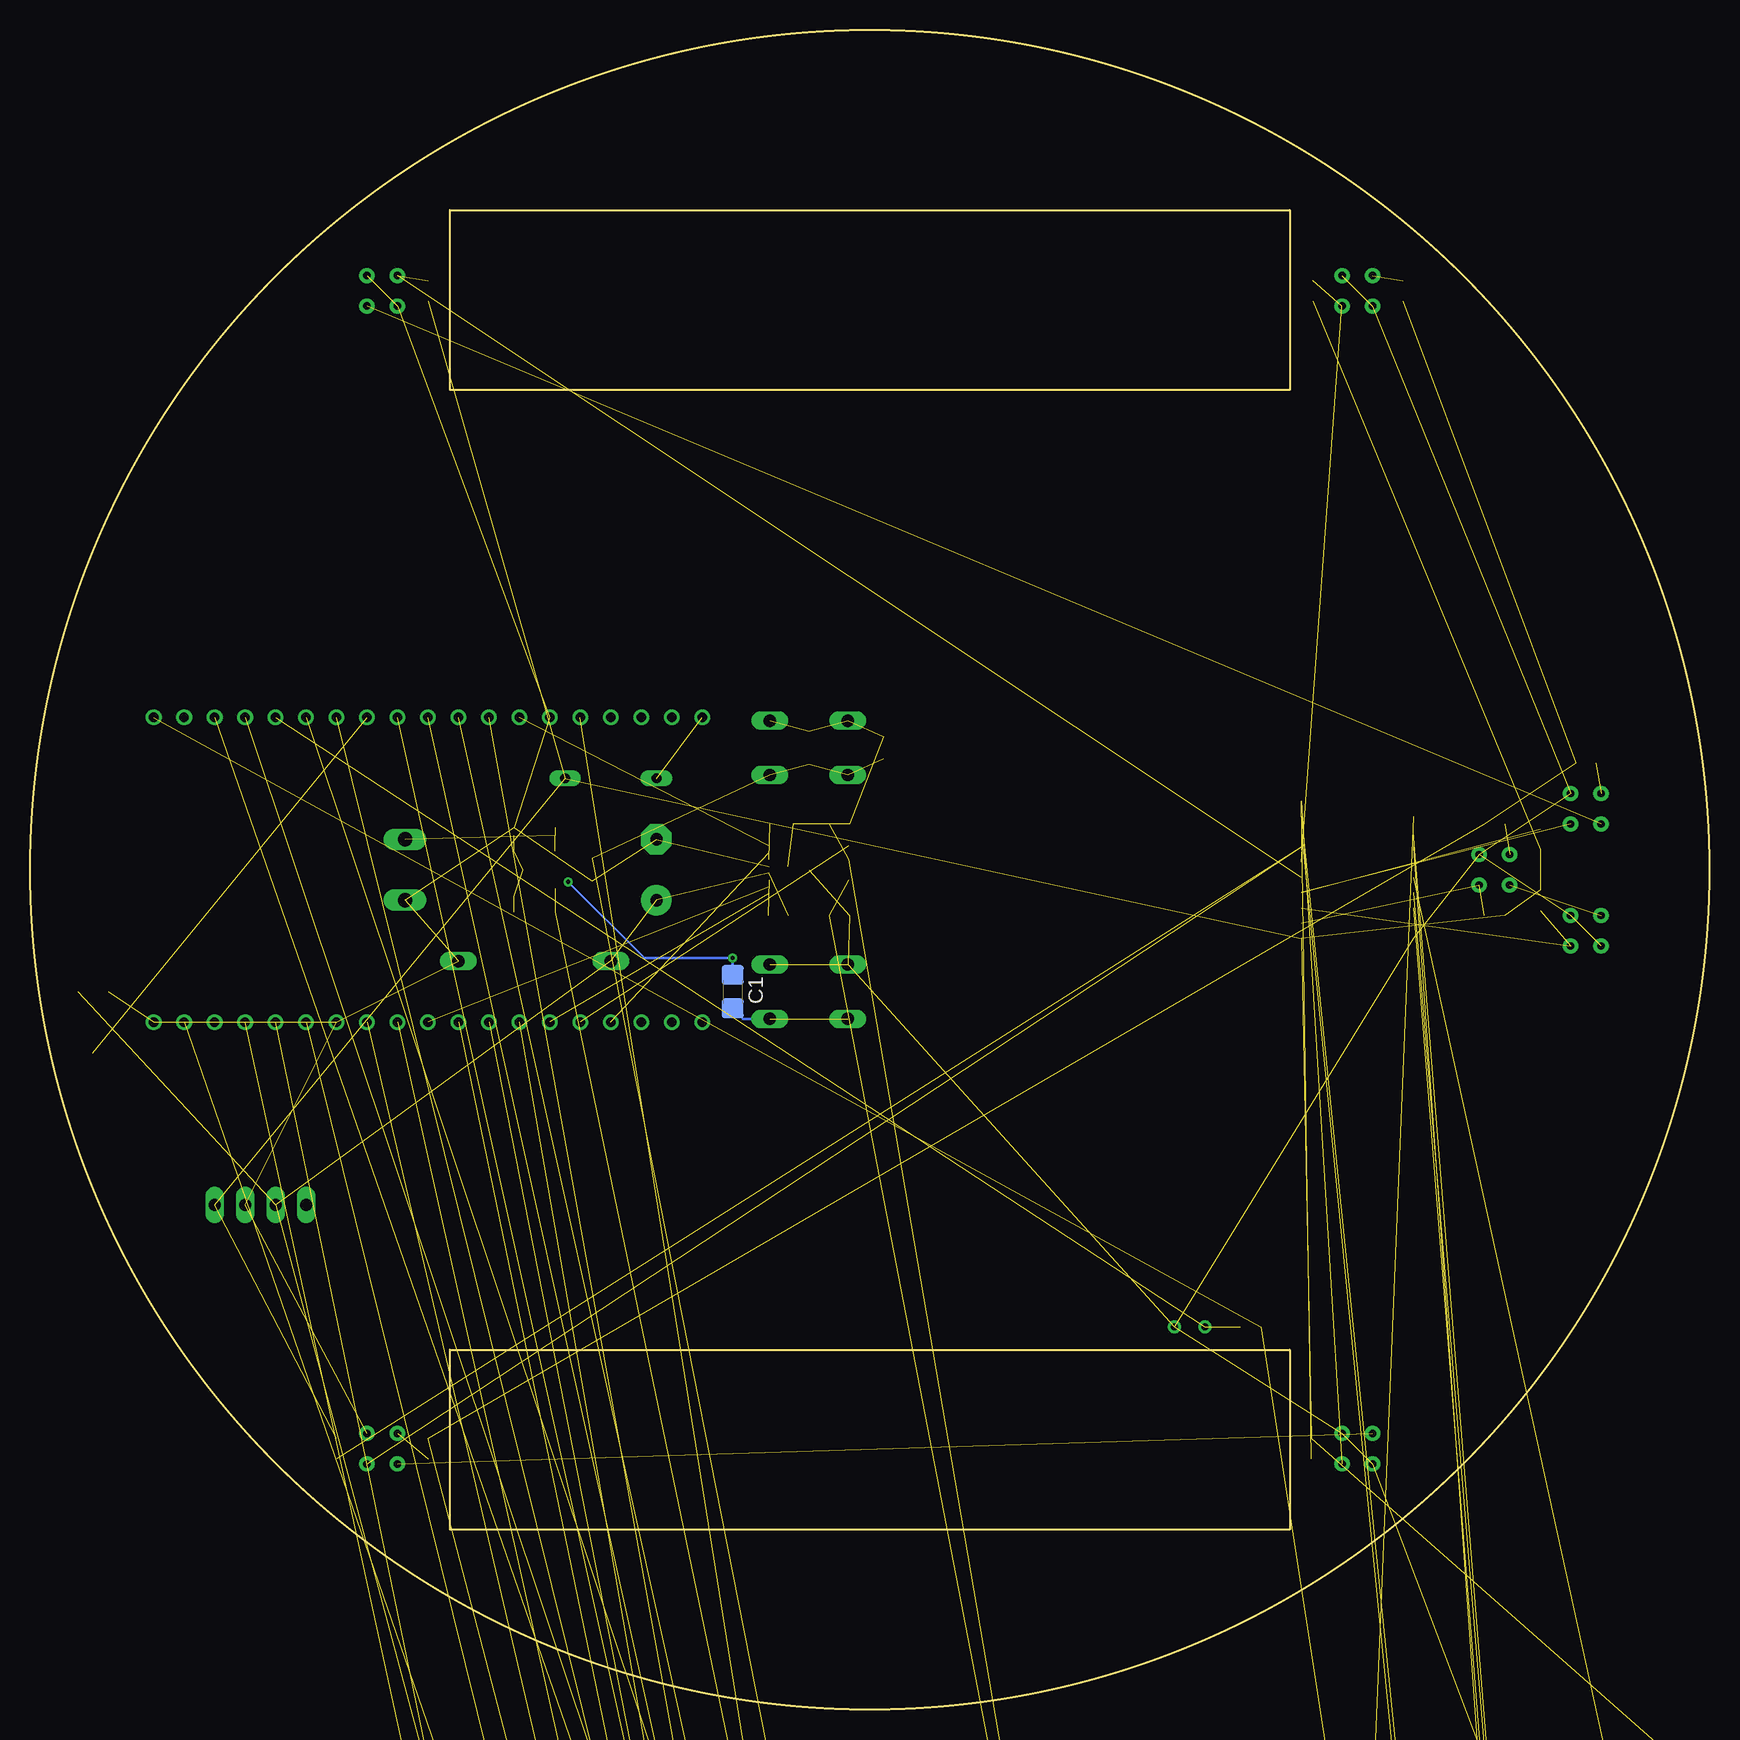
[diagram p6: board, bottom side, seen from below]

Size 140 x 140 mm. Coordinates in mm from the lower left corner, seen from the top.
Outline: 35,30 35,15 105,15 105,30 35,30
Outline: 105,110 105,125 35,125 35,110 105,110
Outline: circle at 70,70 radius 70
Copper layers (1*16): Top 0.035mm / dielectric 1.5mm / Bottom 0.035mm
Design rules "default": minimum track width 6mil, minimum drill 0.35mm, track to track 6mil, track to pad 6mil, pad to pad 6mil, via to via 6mil, smd to smd 6mil, copper to edge 40mil, drill to drill 6mil, minimum pad ring 10mil, minimum via ring 8mil, stop-mask expansion 4mil, vias tented up to drill 0mil, thermal gap 10mil

### Footprints (pad centres in the part's own frame; a part is rotated, then mirrored left to right if it is on the bottom)
C1206 = smd 1.6 x 1.8: 1 -1.4,0; 2 1.4,0
E5-10,5 = drill 1.016 pad 2.54: + -2.54,0 | drill 1.016 pad 2.54 octagon: - 2.54,0
C0805 = smd 1.3 x 1.5: 1 -0.95,0; 2 0.95,0
C0603 = smd 1.1 x 1: 1 -0.85,0; 2 0.85,0
D-7.5 = drill 0.813 long: A 3.81,0; C -3.81,0
F126Z12 = drill 1.016 long: A 6.35,0; C -6.35,0
TSSOP8 = smd 0.35 x 1.2: 1 -0.975,-2.925; 2 -0.325,-2.925; 3 0.325,-2.925; 4 0.975,-2.925; 5 0.975,2.925; 6 0.325,2.925; 7 -0.325,2.925; 8 -0.975,2.925
STEPDOWN = drill 1.016 long: EN 1.27,8.89; GND 1.27,3.81; IN 1.27,6.35; OUT 1.27,1.27
DEVKITC = drill 0.8: 1 -12.7,46.99; 2 -12.7,44.45; 3 -12.7,41.91; 4 -12.7,39.37; 5 -12.7,36.83; 6 -12.7,34.29; 7 -12.7,31.75; 8 -12.7,29.21; 9 -12.7,26.67; 10 -12.7,24.13; 11 -12.7,21.59; 12 -12.7,19.05; 13 -12.7,16.51; 14 -12.7,13.97; 15 -12.7,11.43; 16 -12.7,8.89; 17 -12.7,6.35; 18 -12.7,3.81; 19 -12.7,1.27; 20 12.7,1.27; 21 12.7,3.81; 22 12.7,6.35; 23 12.7,8.89; 24 12.7,11.43; 25 12.7,13.97; 26 12.7,16.51; 27 12.7,19.05; 28 12.7,21.59; 29 12.7,24.13; 30 12.7,26.67; 31 12.7,29.21; 32 12.7,31.75; 33 12.7,34.29; 34 12.7,36.83; 35 12.7,39.37; 36 12.7,41.91; 37 12.7,44.45; 38 12.7,46.99
1X03 = drill 1.016 long: 1 -2.54,0; 2 0,0; 3 2.54,0
2X13 = drill 1.016 octagon: 1 -15.24,-1.27; 2 -15.24,1.27; 3 -12.7,-1.27; 4 -12.7,1.27; 5 -10.16,-1.27; 6 -10.16,1.27; 7 -7.62,-1.27; 8 -7.62,1.27; 9 -5.08,-1.27; 10 -5.08,1.27; 11 -2.54,-1.27; 12 -2.54,1.27; 13 0,-1.27; 14 0,1.27; 15 2.54,-1.27; 16 2.54,1.27; 17 5.08,-1.27; 18 5.08,1.27; 19 7.62,-1.27; 20 7.62,1.27; 21 10.16,-1.27; 22 10.16,1.27; 23 12.7,-1.27; 24 12.7,1.27; 25 15.24,-1.27; 26 15.24,1.27
2X05 = drill 1.016 octagon: 1 -5.08,-1.27; 2 -5.08,1.27; 3 -2.54,-1.27; 4 -2.54,1.27; 5 0,-1.27; 6 0,1.27; 7 2.54,-1.27; 8 2.54,1.27; 9 5.08,-1.27; 10 5.08,1.27
ARK550/2 = drill 1.016 pad 2.54 octagon: 1 0,0; 2 3.493,0
CHIPLED_1206 = smd 1.5 x 1.5: A 0,-1.75; C 0,1.75
SOT23_DIST = smd 1 x 1.2: 1 -0.95,-1.227; 2 0.95,-1.227; 3 0,1.227
MLP3.3X3.3_HS = smd 0.4 x 1.3: 1 -0.975,-1.7; 2 -0.325,-1.7; 3 0.325,-1.7; 4 0.975,-1.7; 5 0.975,1.7; 6 0.325,1.7; 7 -0.325,1.7; 8 -0.975,1.7
SOT23 = smd 1 x 1.4: 1 -0.95,-1.1; 2 0.95,-1.1; 3 0,1.1
R0603 = smd 1 x 1.1: 1 -0.85,0; 2 0.85,0
R0805 = smd 1.3 x 1.5: 1 -0.95,0; 2 0.95,0
M0805 = smd 1.3 x 1.6: 1 -0.95,0; 2 0.95,0
SM-42/43X = smd 1.3 x 1.9: 1 -1.27,-2.55; 3 1.27,-2.55 | smd 2 x 1.9: 2 0,2.55
R0402 = smd 0.7 x 0.9: 1 -0.65,0; 2 0.65,0
B3F-10XX = drill 1.016 long: 1 -3.251,2.261; 2 3.251,2.261; 3 -3.251,-2.261; 4 3.251,-2.261
4 = drill 0.61 pad 1.27: A -1.27,1.27; C 1.27,-1.27; E 1.27,1.27; K -1.27,-1.27
ATTINY1616-SOIC = smd 2.05 x 0.6: +5V -4.655,5.715; GND 4.655,5.715; PA0 4.655,0.635; PA1 4.655,1.905; PA2 4.655,3.175; PA3 4.655,4.445; PA4 -4.655,4.445; PA5 -4.655,3.175; PA6 -4.655,1.905; PA7 -4.655,0.635; PB0 4.655,-5.715; PB1 -4.655,-5.715; PB2 -4.655,-4.445; PB3 -4.655,-3.175; PB4 -4.655,-1.905; PB5 -4.655,-0.635; PC0 4.655,-4.445; PC1 4.655,-3.175; PC2 4.655,-1.905; PC3 4.655,-0.635
HTSSOP = smd 2.31 x 2.46: !GND 0,0 | smd 1.6 x 0.368: AIN1 3.3,1.991; AIN2 3.3,1.422; AISEN -3.3,0.853; AOUT1 -3.3,1.422; AOUT2 -3.3,0.284; BIN1 3.3,-1.991; BIN2 3.3,-1.422; BISEN -3.3,-0.853; BOUT1 -3.3,-1.422; BOUT2 -3.3,-0.284; GND 3.3,0.284; NFAULT -3.3,-1.991; NSLEEP -3.3,1.991; VCP 3.3,-0.853; VINT 3.3,0.853; VM 3.3,-0.284
BIR-NM13C1 = drill 0.6: GND -1.27,0; PIN 1.27,0
L-NP-3C1 = drill 0.6: GND 0,0; PIN 2.54,0
W237-132 = drill 1.194 long: 1 -2.54,-0.635; 2 2.54,-0.635

### Placement (x,y rotation side)
C1  81.43,59.84 270 bottom
C2  75.08,80.16 90 top
C3  11.58,-125.58 0 top  (outside the outline)
C4  11.58,-153.52 0 top  (outside the outline)
C5  26.82,-69.7 0 top  (outside the outline)
C6  87.78,70 90 top
C7  77.37,73.81 180 top
C8  11.58,-181.46 0 top  (outside the outline)
C9  11.58,-209.4 0 top  (outside the outline)
C10  -6.2,-349.1 0 top  (outside the outline)
C11  -6.2,-354.18 0 top  (outside the outline)
C12  -6.2,-359.26 0 top  (outside the outline)
C13  -6.2,-384.66 0 top  (outside the outline)
C23  77.62,66.19 180 top
D2  91.59,77.62 0 top
D3  97.94,62.38 0 top
IC1  -6.2,-260.2 0 top  (outside the outline)
IM3  125.88,40.79 90 top
IM6  82.7,70 270 top
JP1  3.96,-36.68 0 top  (outside the outline)
JP2  9.04,-404.98 0 top  (outside the outline)
JP3  -21.44,-491.34 0 top  (outside the outline)
JP4  -1.12,-455.78 0 top  (outside the outline)
JP5  -21.44,-498.96 0 top  (outside the outline)
JP6  -3.66,-443.08 0 top  (outside the outline)
JP7  9.04,-427.84 0 top  (outside the outline)
JP8  9.04,-420.22 0 top  (outside the outline)
K1  -23.98,-481.18 0 top  (outside the outline)
LED1  3.96,-125.58 0 top  (outside the outline)
LED2  3.96,-153.52 0 top  (outside the outline)
LED3  26.82,-62.08 0 top  (outside the outline)
LED4  3.96,-181.46 0 top  (outside the outline)
LED5  3.96,-209.4 0 top  (outside the outline)
Q1  -6.2,-305.92 0 top  (outside the outline)
Q2  97.94,67.46 90 top
Q3  -6.2,-435.46 0 top  (outside the outline)
Q4  -6.2,-323.7 0 top  (outside the outline)
Q5  97.94,72.54 90 top
Q6  94.26,70 270 top
Q7  -13.82,-453.24 0 top  (outside the outline)
Q8  -3.66,-397.36 0 top  (outside the outline)
Q9  -13.82,-463.4 0 top  (outside the outline)
Q10  -23.98,-506.58 0 top  (outside the outline)
R1  17.93,73.81 180 top
R2  17.93,66.19 180 top
R3  -13.82,-476.1 0 top  (outside the outline)
R4  14.12,67.46 90 top
R5  10.31,78.89 180 top
R6  14.12,72.54 270 top
R7  -13.82,-483.72 0 top  (outside the outline)
R8  106.83,118.26 270 top
R9  25.55,118.26 90 top
R10  33.04,118.26 270 top
R11  106.83,21.74 270 top
R12  114.45,21.74 90 top
R13  -23.98,-511.66 0 top  (outside the outline)
R14  33.17,21.74 90 top
R15  68.86,80.16 90 top
R16  -13.82,-468.48 0 top  (outside the outline)
R17  97.94,70 180 top
R18  81.43,59.84 270 top
R19  72.54,73.81 0 top
R20  134.77,57.3 180 top
R21  -6.2,-448.16 0 top  (outside the outline)
R22  -1.12,-448.16 0 top  (outside the outline)
R23  1.42,-110.34 0 top  (outside the outline)
R24  31.9,-77.32 0 top  (outside the outline)
R25  1.42,-6.2 0 top  (outside the outline)
R26  -6.2,-311 0 top  (outside the outline)
R27  -6.2,-316.08 0 top  (outside the outline)
R28  -6.2,-328.78 0 top  (outside the outline)
R29  1.42,-84.94 0 top  (outside the outline)
R30  -6.2,-338.94 0 top  (outside the outline)
R31  -6.2,-344.02 0 top  (outside the outline)
R32  -6.2,-333.86 0 top  (outside the outline)
R33  -6.2,-364.34 0 top  (outside the outline)
R34  38.25,31.9 0 top
R35  -6.2,-369.42 0 top  (outside the outline)
R36  -6.2,-272.9 0 top  (outside the outline)
R37  -6.2,-283.06 0 top  (outside the outline)
R38  1.42,-133.2 0 top  (outside the outline)
R39  9.04,-133.2 0 top  (outside the outline)
R40  1.42,-138.28 0 top  (outside the outline)
R41  1.42,-161.14 0 top  (outside the outline)
R42  9.04,-161.14 0 top  (outside the outline)
R43  1.42,-166.22 0 top  (outside the outline)
R44  1.42,-189.08 0 top  (outside the outline)
R45  9.04,-189.08 0 top  (outside the outline)
R46  1.42,-194.16 0 top  (outside the outline)
R47  1.42,-217.02 0 top  (outside the outline)
R48  9.04,-217.02 0 top  (outside the outline)
R49  1.42,-222.1 0 top  (outside the outline)
R50  1.42,-239.88 0 top  (outside the outline)
R51  -6.2,-374.5 0 top  (outside the outline)
R52  1.42,-250.04 0 top  (outside the outline)
R53  -6.2,-379.58 0 top  (outside the outline)
R54  -6.2,-290.68 0 top  (outside the outline)
R55  -6.2,-298.3 0 top  (outside the outline)
R62  72.54,66.19 0 top
SW0  6.5,-44.3 0 top  (outside the outline)
SW1  6.5,-117.96 0 top  (outside the outline)
SW2  6.5,-145.9 0 top  (outside the outline)
SW3  6.5,-173.84 0 top  (outside the outline)
SW4  75.08,59.84 0 top
SW5  75.08,80.16 0 top
SW6  6.5,-201.78 0 top  (outside the outline)
U$1  10.31,64.92 0 top
U$2  17.93,70 0 top
U$3  10.31,75.08 0 top
U$4  110.64,118.26 180 top
U$5  29.36,118.26 0 top
U$6  110.64,21.74 0 top
U$7  29.36,21.74 0 top
U$8  29.36,70 180 top
U$9  75.08,70 0 top
U$11  -6.2,-267.82 0 top  (outside the outline)
U$13  44.6,31.9 180 top
U$15  -6.2,-275.44 0 top  (outside the outline)
U$16  1.42,-13.82 0 top  (outside the outline)
U$20  -6.2,-277.98 0 top  (outside the outline)
U$21  -6.2,-285.6 0 top  (outside the outline)
U$22  -6.2,-293.22 0 top  (outside the outline)
U$23  -6.2,-300.84 0 top  (outside the outline)
X4  108.1,70 90 top

### Tracks (layer width: path | path; a pad name or v marks a point on that pad's centre or on a via)
!RESET  (1 unrouted)
+3V3  (38 unrouted)
+5V  (33 unrouted)
+5V_ESP  (1 unrouted)
ADC0  (2 unrouted)
ADC1  (2 unrouted)
ADC2  (2 unrouted)
ADC3  (2 unrouted)
ADC4  (2 unrouted)
ADC5  (2 unrouted)
ADC6  (2 unrouted)
AMPLIFIED_I-MOT_A  (2 unrouted)
AMPLIFIED_I-MOT_B  (2 unrouted)
BAT1  (4 unrouted)
BAT-REF  (1 unrouted)
BAT_POL+  (6 unrouted)
  pour Top: 99.21,72.92 99.21,65.81 100.73,65.81 101.11,66.19 101.11,72.92
ENC-A0  (2 unrouted)
ENC-A1  (2 unrouted)
ENC-B0  (2 unrouted)
ENC-B1  (2 unrouted)
GND  (100 unrouted)
  Top 0.305: U$9.GND 76.87,70.28 76.59,70 75.08,70
I-LED  (2 unrouted)
I-MOT_A  (2 unrouted)
I-MOT_B  (2 unrouted)
IO4  (2 unrouted)
IO13  (2 unrouted)
IO14  (2 unrouted)
IO16  (2 unrouted)
IO17  (2 unrouted)
IO18  (2 unrouted)
IO19  (2 unrouted)
IO25  (2 unrouted)
IO26  (2 unrouted)
IO27  (2 unrouted)
IO32  (2 unrouted)
IR-LED-POWER  (1 unrouted)
N$1  (1 unrouted)
N$2  (1 unrouted)
N$3  (1 unrouted)
N$4  (1 unrouted)
N$5  (1 unrouted)
N$6  (1 unrouted)
N$7  (6 unrouted)
N$9  (5 unrouted)
N$10  (1 unrouted)
N$11  (2 unrouted)
N$12  (1 unrouted)
N$13  (1 unrouted)
  Top 0.203: R18.2 81.43,57.94 81.07,57.58 SW4.4
  Bottom 0.203: SW4.4 80.57,57.58 C1.2
N$18  (2 unrouted)
N$19  (2 unrouted)
N$20  (2 unrouted)
N$21  (1 unrouted)
N$22  (1 unrouted)
N$23  (1 unrouted)
N$24  (1 unrouted)
N$25  (1 unrouted)
N$26  (1 unrouted)
N$27  (1 unrouted)
N$28  (1 unrouted)
N$29  (1 unrouted)
N$30  (2 unrouted)
N$31  (1 unrouted)
N$32  (2 unrouted)
N$33  (2 unrouted)
N$34  (6 unrouted)
N$35  (2 unrouted)
N$36  (2 unrouted)
PB3  (3 unrouted)
PC0  (3 unrouted)
PC1  (3 unrouted)
PC2  (3 unrouted)
PC7  (2 unrouted)
PWM_A0  (1 unrouted)
PWM_A1  (1 unrouted)
PWM_B0  (1 unrouted)
PWM_B1  (1 unrouted)
RX  (2 unrouted)
SCL  (2 unrouted)
SCL-5V  (2 unrouted)
SDA  (1 unrouted)
SDA-5V  (2 unrouted)
SLEEP  (1 unrouted)
START_GATE1  (via drill 0.35)
  Top 0.203: Q2.4 99.64,68.81 99.5,68.95 98.1,68.95 97.94,69.11 97.94,69.87 97.81,70 R17.2 | R18.1 v81.43,62.63 | v95.13,69 95.36,69.22 Q6.3
  Top 0.305: Q6.3 R17.2
  Bottom 0.203: C1.1 v81.43,62.63 88.77,62.63 v95.13,69
SW0  (4 unrouted)
SW1  (4 unrouted)
SW2  (4 unrouted)
SW3  (4 unrouted)
SW4  (4 unrouted)
TX  (2 unrouted)
VCC  (9 unrouted)